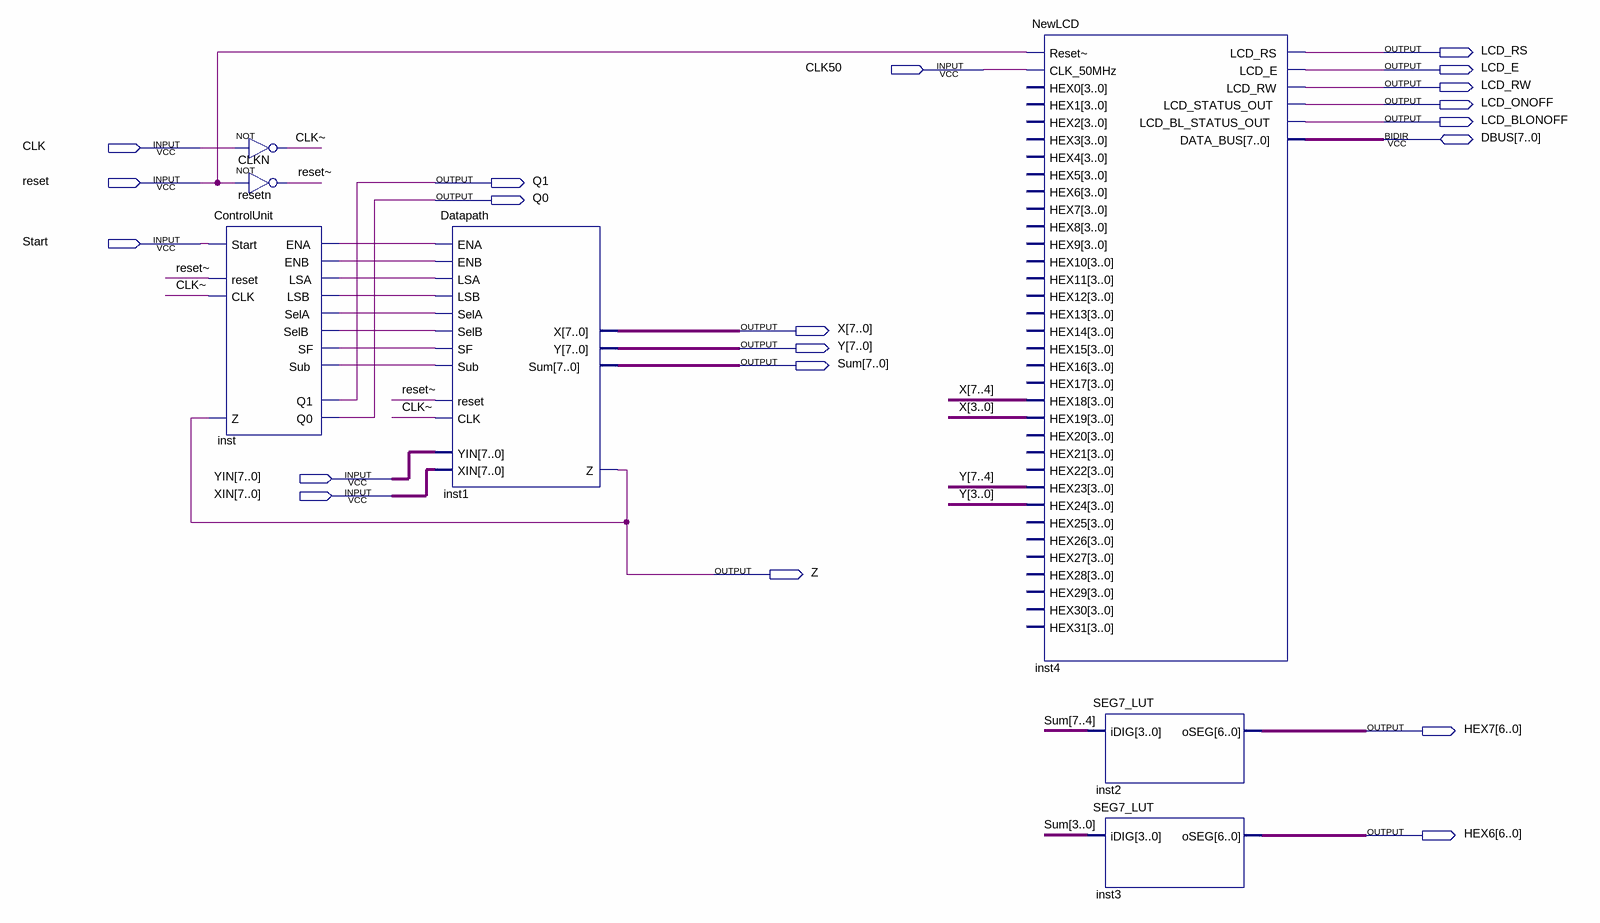
[diagram p0: schematic sheet]
// Quartus schematic Question1.bdf as structural Verilog: 7 symbols, 20 pins
module Question1 (
  input  CLK50,
  input  CLK,
  input  reset,
  input  Start,
  input  [7:0] YIN,
  input  [7:0] XIN,
  inout  [7:0] DBUS,
  output LCD_RS,
  output LCD_E,
  output LCD_RW,
  output LCD_ONOFF,
  output LCD_BLONOFF,
  output Q1,
  output Q0,
  output [7:0] X,
  output [7:0] Y,
  output [7:0] Sum,
  output Z,
  output [6:0] HEX7,
  output [6:0] HEX6
);

  wire \CLK~ , inst_ena, inst_enb, inst_lsa, inst_lsb, inst_sela, inst_selb, inst_sf, inst_sub, \reset~ ;

  not CLKN (\CLK~ , CLK);
  not resetn (\reset~ , reset);
  ControlUnit inst (
    .Start(Start), .Z(Z), .reset(\reset~ ), .CLK(\CLK~ ), .Q0(Q0), .Q1(Q1), .SelA(inst_sela), .ENA(inst_ena),
    .ENB(inst_enb), .LSB(inst_lsb), .Sub(inst_sub), .SF(inst_sf), .LSA(inst_lsa), .SelB(inst_selb));
  Datapath inst1 (
    .Sub(inst_sub), .CLK(\CLK~ ), .reset(\reset~ ), .ENA(inst_ena), .SF(inst_sf), .LSA(inst_lsa),
    .SelA(inst_sela), .XIN(XIN), .ENB(inst_enb), .LSB(inst_lsb), .SelB(inst_selb), .YIN(YIN), .Z(Z), .X(X),
    .Sum(Sum), .Y(Y));
  NewLCD inst4 (
    .\Reset~ (reset), .CLK_50MHz(CLK50), .HEX18(X[7:4]), .HEX19(X[3:0]), .HEX23(Y[7:4]), .HEX24(Y[3:0]),
    .LCD_RS(LCD_RS), .LCD_E(LCD_E), .LCD_RW(LCD_RW), .LCD_STATUS_OUT(LCD_ONOFF),
    .LCD_BL_STATUS_OUT(LCD_BLONOFF), .DATA_BUS(DBUS));  // open: HEX0, HEX1, HEX2, HEX3, HEX4, HEX5, HEX6, HEX7, HEX8, HEX9, HEX10, HEX11, HEX12, HEX13, HEX14, HEX15, HEX16, HEX17, HEX20, HEX21, HEX22, HEX25, HEX26, HEX27, HEX28, HEX29, HEX30, HEX31
  SEG7_LUT inst2 (.iDIG(Sum[7:4]), .oSEG(HEX7));
  SEG7_LUT inst3 (.iDIG(Sum[3:0]), .oSEG(HEX6));
endmodule
